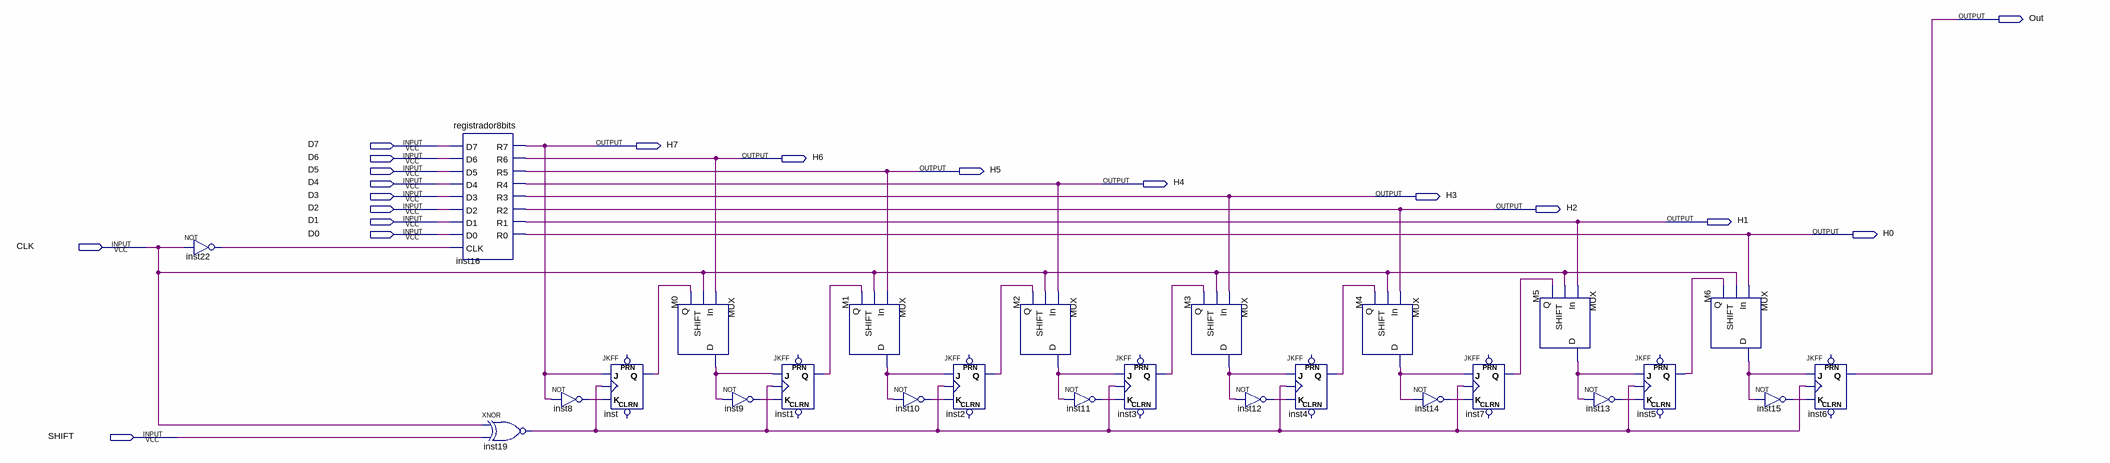
[diagram p0: schematic sheet]
// Quartus schematic PISOregister.bdf as structural Verilog: 26 symbols, 19 pins
module PISOregister (
  input  D7,
  input  D6,
  input  D5,
  input  D4,
  input  D3,
  input  D2,
  input  D1,
  input  D0,
  input  CLK,
  input  SHIFT,
  output Out,
  output H7,
  output H6,
  output H5,
  output H4,
  output H3,
  output H2,
  output H1,
  output H0
);

  wire inst1_q, inst2_q, inst3_q, inst4_q, inst5_q, inst7_q, inst8_out, inst9_out, inst10_out, inst11_out,
       inst12_out, inst13_out, inst14_out, inst15_out, inst19_out, inst22_out, inst_q, M0_d, M1_d, M2_d,
       M3_d, M4_d, M5_d, M6_d;

  not inst22 (inst22_out, CLK);
  registrador8bits inst16 (
    .D7(D7), .D6(D6), .D5(D5), .D4(D4), .D3(D3), .D2(D2), .D1(D1), .D0(D0), .CLK(inst22_out), .R7(H7),
    .R6(H6), .R5(H5), .R4(H4), .R3(H3), .R2(H2), .R1(H1), .R0(H0));
  xnor inst19 (inst19_out, CLK, SHIFT);
  not inst8 (inst8_out, H7);
  JKFF inst (.K(inst8_out), .J(H7), .CLK(inst19_out), .Q(inst_q));  // open: PRN, CLRN
  MUX M0 (.In(H6), .SHIFT(CLK), .Q(inst_q), .D(M0_d));
  not inst9 (inst9_out, M0_d);
  JKFF inst1 (.K(inst9_out), .J(M0_d), .CLK(inst19_out), .Q(inst1_q));  // open: PRN, CLRN
  MUX M1 (.In(H5), .SHIFT(CLK), .Q(inst1_q), .D(M1_d));
  not inst10 (inst10_out, M1_d);
  JKFF inst2 (.K(inst10_out), .J(M1_d), .CLK(inst19_out), .Q(inst2_q));  // open: PRN, CLRN
  MUX M2 (.In(H4), .SHIFT(CLK), .Q(inst2_q), .D(M2_d));
  not inst11 (inst11_out, M2_d);
  JKFF inst3 (.K(inst11_out), .J(M2_d), .CLK(inst19_out), .Q(inst3_q));  // open: PRN, CLRN
  MUX M3 (.In(H3), .SHIFT(CLK), .Q(inst3_q), .D(M3_d));
  not inst12 (inst12_out, M3_d);
  JKFF inst4 (.K(inst12_out), .J(M3_d), .CLK(inst19_out), .Q(inst4_q));  // open: PRN, CLRN
  MUX M4 (.In(H2), .SHIFT(CLK), .Q(inst4_q), .D(M4_d));
  not inst14 (inst14_out, M4_d);
  JKFF inst7 (.K(inst14_out), .J(M4_d), .CLK(inst19_out), .Q(inst7_q));  // open: PRN, CLRN
  MUX M5 (.In(H1), .SHIFT(CLK), .Q(inst7_q), .D(M5_d));
  not inst13 (inst13_out, M5_d);
  JKFF inst5 (.K(inst13_out), .J(M5_d), .CLK(inst19_out), .Q(inst5_q));  // open: PRN, CLRN
  MUX M6 (.In(H0), .SHIFT(CLK), .Q(inst5_q), .D(M6_d));
  not inst15 (inst15_out, M6_d);
  JKFF inst6 (.K(inst15_out), .J(M6_d), .CLK(inst19_out), .Q(Out));  // open: PRN, CLRN
endmodule
